# EAGLE schematic LPP MainBoard Gen_1_Ver_1 (EAGLE 7.5.0)
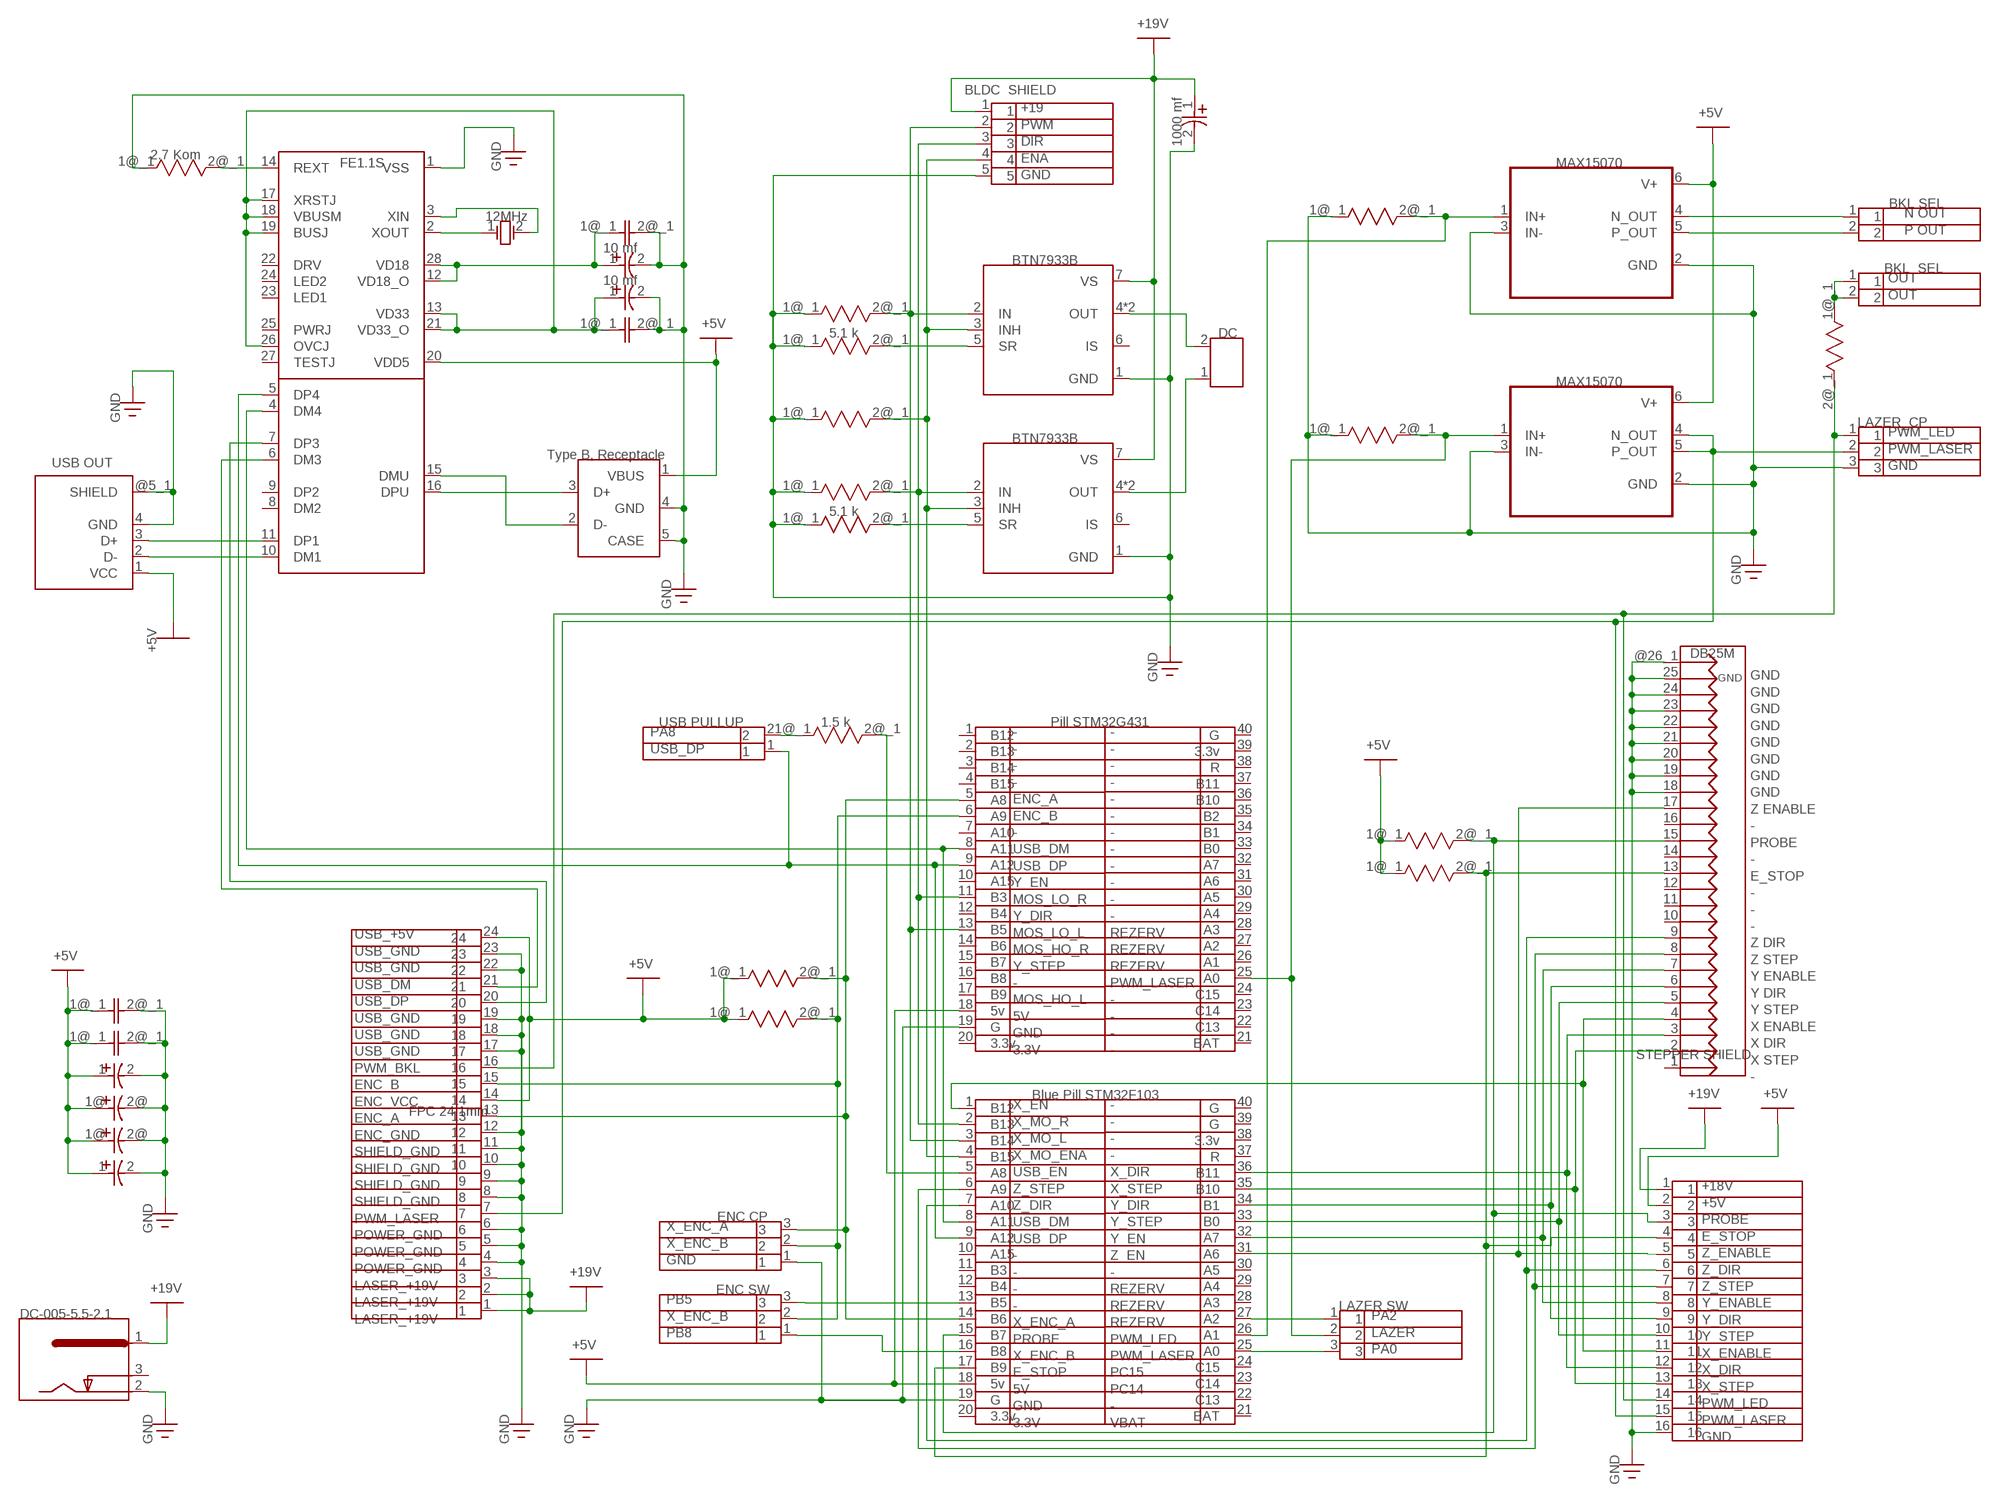
[diagram p0: schematic, sheet 1]

## Parts
BLDC  BLDC SHIELD  PLS_5  [PLS_5]
C1  1000 mf  CAP_P_5MM  [CAP_P_5MM]
C2  CAP_0805_1206  [СAP_0805_1206]
C3  10 mf  CAP_P_3MM  [CAP_P_3MM]
C4  10 mf  CAP_P_3MM  [CAP_P_3MM]
C5  CAP_0805_1206  [СAP_0805_1206]
C6  CAP_SMD_P_5MM  [СAP_P_SMD_5MM]
C7  CAP_SMD_P_5MM  [СAP_P_SMD_5MM]
C8  CAP_0805_1206  [СAP_0805_1206]
C9  CAP_0805_1206  [СAP_0805_1206]
C10  CAP_P_5MM  [CAP_P_5MM]
C11  CAP_P_5MM  [CAP_P_5MM]
CNC  DB25M  [DB25M]
DC  DC  2_SCREW_TERM._BLK.  [2_SCREW_TERM._BLK.]
DC_IN  DC-005-5.5-2.1  J-1  [J-1]
ENC_CP  ENC CP  PLS_3  [PLS_3]
ENC_SW  ENC SW  PLS_3  [PLS_3]
FPC  FPC 24 1mm  FPC_24_1MM  [FPC_24_1MM]
IC1  FE1.1S  [SOP64P600X175-28N]
LAZER_CP  LAZER_CP  PLS_3  [PLS_3]
LAZER_SW  LAZER SW  PLS_3  [PLS_3]
R1  2.7 Kom  R_0805_1206  [R_0805_1206]
R2  R_0805_1206  [R_0805_1206]
R3  R_0805_1206  [R_0805_1206]
R4  R_0805_1206  [R_0805_1206]
R5  5.1 k  R_0805_1206  [R_0805_1206]
R6  R_0805_1206  [R_0805_1206]
R7  R_0805_1206  [R_0805_1206]
R8  R_0805_1206  [R_0805_1206]
R9  5.1 k  R_0805_1206  [R_0805_1206]
R10  1.5 k  R_0805_1206  [R_0805_1206]
R11  R_0805_1206  [R_0805_1206]
R12  R_0805_1206  [R_0805_1206]
R13  R_0805_1206  [R_0805_1206]
R14  R_0805_1206  [R_0805_1206]
STEPPER_SHIELD  STEPPER SHIELD  PLS_16  [PLS_16]
U1  MAX15070  MAX15070AAUT+T  [SOT95P280X145-6N]
U3  BTN7933B  [TO127P1500X440-8N]
U4  MAX15070  MAX15070AAUT+T  [SOT95P280X145-6N]
U5  BTN7933B  [TO127P1500X440-8N]
U7  Pill STM32G431  PILL_STM32G431  [ST_PILL]
U8  Blue Pill STM32F103  BLUE_PILL_STM32F103  [ST_PILL]
USB_IN  Type B, Receptacle  USB-1_TYPE_B  [USB-1_TYPE_B]
USB_OUT  USB OUT  USB_TYPE_A_HORIZONTAL  [USB_TYPE_A_HORIZONTAL]
USB_PULLUP  USB PULLUP  PLS_2  [PLS_2]
XP2  BKL SEL  PLS_2  [PLS_2]
XP3  BKL SEL  PLS_2  [PLS_2]
Z  12MHz  Q_1  [Q_1]

## Nets
Сеть_0: BLDC.5 C1.2(MINUS) C2.2@_1 C3.2(MINUS) C4.2(MINUS) C5.2@_1 C6.2@(MINUS) C7.2@(MINUS) C8.2@_1 C9.2@_1 C10.2(MINUS) C11.2(MINUS) CNC.18 CNC.19 CNC.20 CNC.21 CNC.22 CNC.23 CNC.24 CNC.25 CNC.@26_1(GND) DC_IN.2 ENC_CP.1 FPC.4 FPC.5 FPC.6 FPC.8 FPC.9 FPC.10 FPC.11 FPC.12 FPC.17 FPC.18 FPC.19 FPC.22 FPC.23 IC1.1(VSS) LAZER_CP.3 R1.1@_1 R2.1@_1 R3.1@_1 R5.1@_1 R6.1@_1 R7.1@_1 R8.1@_1 R9.1@_1 STEPPER_SHIELD.16 U1.2(GND) U1.3(IN-) U3.1(GND) U4.2(GND) U4.3(IN-) U5.1(GND) U7.19(G) U8.19(G) USB_IN.4(GND) USB_IN.5(CASE) USB_OUT.4(GND) USB_OUT.@5_1(SHIELD) ; supply symbol labelled GND
Сеть_1: IC1.3(XIN) Z.2(OSC2)
Сеть_2: IC1.2(XOUT) Z.1(OSC1)
Сеть_3: DC.2 U3.4(OUT) U3.8(OUT)
Сеть_4: R10.2@_1 U8.5(A8)
Сеть_5: DC.1 U5.4(OUT) U5.8(OUT)
Сеть_6: ENC_CP.3 FPC.13 R13.2@_1 U7.5(A8) U8.14(B6)
Сеть_7: C6.1@(PLUS) C7.1@(PLUS) C8.1@_1 C9.1@_1 C10.1(PLUS) C11.1(PLUS) FPC.14 FPC.24 IC1.20(VDD5) R11.1@_1 R12.1@_1 R13.1@_1 R14.1@_1 STEPPER_SHIELD.2 U1.6(V+) U4.6(V+) U7.18(5v) U8.18(5v) USB_IN.1(VBUS) USB_OUT.1(VCC) ; supply symbol labelled +5V
Сеть_8: IC1.11(DP1) USB_OUT.3(D+)
Сеть_9: R10.1@_1 USB_PULLUP.2
Сеть_11: IC1.10(DM1) USB_OUT.2(D-)
Сеть_12: FPC.20 IC1.7(DP3)
Сеть_13: CNC.3 STEPPER_SHIELD.12 U8.36(B11)
Сеть_14: FPC.21 IC1.6(DM3)
Сеть_15: IC1.16(DPU) USB_IN.3(D+)
Сеть_16: BLDC.1 C1.1(PLUS) DC_IN.1 FPC.1 FPC.2 FPC.3 STEPPER_SHIELD.1 U3.7(VS) U5.7(VS) ; supply symbol labelled +19V
Сеть_17: CNC.13 R12.2@_1 STEPPER_SHIELD.4 U8.17(B9)
Сеть_18: R9.2@_1 U5.5(SR)
Сеть_19: CNC.5 STEPPER_SHIELD.10 U8.33(B0)
Сеть_20: CNC.6 STEPPER_SHIELD.9 U8.34(B1)
Сеть_21: CNC.7 STEPPER_SHIELD.8 U8.32(A7)
Сеть_22: CNC.8 STEPPER_SHIELD.7 U8.6(A9)
Сеть_23: BLDC.4 R6.2@_1 U3.3(INH) U5.3(INH) U8.4(B15)
Сеть_24: IC1.15(DMU) USB_IN.2(D-)
Сеть_25: CNC.9 STEPPER_SHIELD.6 U8.7(A10)
Сеть_26: CNC.17 STEPPER_SHIELD.5 U8.31(A6)
Сеть_27: ENC_SW.1 U8.16(B8)
Сеть_28: ENC_SW.3 U8.13(B5)
Сеть_29: CNC.4 STEPPER_SHIELD.11 U8.1(B12)
Сеть_30: FPC.7 LAZER_CP.2 STEPPER_SHIELD.15 U4.4(N_OUT) U4.5(P_OUT)
Сеть_31: R5.2@_1 U3.5(SR)
Сеть_32: CNC.15 R11.2@_1 STEPPER_SHIELD.3 U8.15(B7)
Сеть_33: ENC_CP.2 ENC_SW.2 FPC.15 R14.2@_1 U7.6(A9)
Сеть_34: BLDC.2 R3.2@_1 U3.2(IN) U7.13(B5) U8.3(B14)
Сеть_35: BLDC.3 R8.2@_1 U5.2(IN) U7.11(B3) U8.2(B13)
Сеть_36: CNC.2 STEPPER_SHIELD.13 U8.35(B10)
Сеть_37: LAZER_SW.2 R7.2@_1 U4.1(IN+) U7.25(A0)
Сеть_38: R2.2@_1 U1.1(IN+) U8.26(A1)
Сеть_39: IC1.4(DM4) U7.8(A11) U8.8(A11)
Сеть_40: IC1.5(DP4) U7.9(A12) U8.9(A12) USB_PULLUP.1
Сеть_41: C4.1(PLUS) C5.1@_1 IC1.13(VD33) IC1.17(XRSTJ) IC1.18(VBUSM) IC1.19(BUSJ) IC1.21(VD33_O) IC1.26(OVCJ)
Сеть_42: C2.1@_1 C3.1(PLUS) IC1.12(VD18_O) IC1.28(VD18)
Сеть_43: IC1.14(REXT) R1.2@_1
Сеть_44: LAZER_SW.3 U8.25(A0)
Сеть_45: LAZER_SW.1 U8.27(A2)
Сеть_46: U1.4(N_OUT) XP2.1
Сеть_47: U1.5(P_OUT) XP2.2
Сеть_48: R4.1@_1 XP3.1 XP3.2
Сеть_49: FPC.16 LAZER_CP.1 R4.2@_1 STEPPER_SHIELD.14
Unconnected: CNC.1 CNC.10 CNC.11 CNC.12 CNC.14 CNC.16 IC1.8(DM2) IC1.9(DP2) IC1.22(DRV) IC1.23(LED1) IC1.24(LED2) IC1.25(PWRJ) IC1.27(TESTJ) U3.6(IS) U5.6(IS) U7.1(B12) U7.2(B13) U7.3(B14) U7.4(B15) U7.7(A10) U7.10(A15) U7.12(B4) U7.14(B6) U7.15(B7) U7.16(B8) U7.17(B9) U7.20(3.3v) U7.21(BAT) U7.22(C13) U7.23(C14) U7.24(C15) U7.26(A1) U7.27(A2) U7.28(A3) U7.29(A4) U7.30(A5) U7.31(A6) U7.32(A7) U7.33(B0) U7.34(B1) U7.35(B2) U7.36(B10) U7.37(B11) U7.38(R) U7.39(3.3v) U7.40(G) U8.10(A15) U8.11(B3) U8.12(B4) U8.20(3.3v) U8.21(BAT) U8.22(C13) U8.23(C14) U8.24(C15) U8.28(A3) U8.29(A4) U8.30(A5) U8.37(R) U8.38(3.3v) U8.39(G) U8.40(G)

## Notes on the sheet
- +19V
- BLDC  SHIELD
- +19
  PWM
  DIR
  ENA
  GND
- +5V
- 1000 mf
- 2.7 Kom
- FE1.1S | GND | MAX15070
- BKL SEL
- N OUT
  P OUT
- 12MHz
- 10 mf
- BTN7933B
- BKL  SEL
- OUT
  OUT
- 10 mf
- +5V
- 5.1 k | DC
- MAX15070
- GND
- LAZER_CP
- PWM_LED
  PWM_LASER
  GND
- BTN7933B
- Type B, Receptacle
- USB OUT
- 5.1 k
- GND
- GND
- +5V
- DB25M
- GND
  GND
  GND
  GND
  GND
  GND
  GND
  GND
  Z ENABLE
  -
  PROBE
  -
  E_STOP
  -
  -
  -
  Z DIR
  Z STEP
  Y ENABLE
  Y DIR
  Y STEP
  X ENABLE
  X DIR
  X STEP
  -
- GND | GND
- USB PULLUP | 1.5 k | Pill STM32G431
- PA8
  USB_DP
- -
  -
  -
  -
  ENC_A
  ENC_B
  -
  USB_DM
  USB_DP
  Y_EN
  MOS_LO_R
  Y_DIR
  MOS_LO_L
  MOS_HO_R
  Y_STEP
  -
  MOS_HO_L
  5V
  GND
  3.3V
- -
  -
  -
  -
  -
  -
  -
  -
  -
  -
  -
  -
  REZERV
  REZERV
  REZERV
  PWM_LASER
  -
  -
  -
  -
- +5V
- USB_+5V
  USB_GND
  USB_GND
  USB_DM
  USB_DP
  USB_GND
  USB_GND
  USB_GND
  PWM_BKL
  ENC_B
  ENC_VCC
  ENC_A
  ENC_GND
  SHIELD_GND
  SHIELD_GND
  SHIELD_GND
  SHIELD_GND
  PWM_LASER
  POWER_GND
  POWER_GND
  POWER_GND
  LASER_+19V
  LASER_+19V
  LASER_+19V
- +5V
- +5V
- STEPPER SHIELD
- Blue Pill STM32F103 | +19V | +5V
- X_EN
  X_MO_R 
  X_MO_L 
  X_MO_ENA
  USB_EN
  Z_STEP
  Z_DIR
  USB_DM
  USB_DP
  -
  -
  -
  -
  X_ENC_A
  PROBE
  X_ENC_B
  E_STOP
  5V
  GND
  3.3V
- -
  -
  -
  -
  X_DIR
  X_STEP
  Y_DIR
  Y_STEP
  Y_EN
  Z_EN
  -
  REZERV
  REZERV
  REZERV
  PWM_LED
  PWM_LASER
  PC15
  PC14
  -
  VBAT
- FPC 24 1mm
- +18V
  +5V
  PROBE
  E_STOP
  Z_ENABLE
  Z_DIR
  Z_STEP
  Y_ENABLE
  Y_DIR
  Y_STEP
  X_ENABLE
  X_DIR
  X_STEP
  PWM_LED
  PWM_LASER
  GND
- ENC CP
- X_ENC_A
  X_ENC_B
  GND
- GND
- +19V
- +19V | ENC SW
- PB5
  X_ENC_B
  PВ8
- LAZER SW
- PA2
  LAZER
  PA0
- DC-005-5.5-2.1
- +5V
- GND | GND | GND
- GND

## Power pins joined to a net without a drawn wire
3: DC_IN.3

## Library data of the parts
BLDC = common:PLS_5; AUTHOR: Даньковский В.И.; MAIL: dvi534538@mail/ru; WEB: http://vinratel.at.ua/
C1 = common:CAP_P_5MM
C2 C5 C8 C9 = common:CAP_0805_1206
C3 C4 = common:CAP_P_3MM
C6 C7 = common:CAP_SMD_P_5MM
C10 C11 = common:CAP_P_5MM; VALUE: 1000 mf
CNC = common:DB25M; UNIQUE_NAME: TE_DB25M
DC = common:2_SCREW_TERM._BLK.
DC_IN = common:J-1
ENC_CP = common:PLS_3; AUTHOR: Даньковский В.И.; MAIL: dvi534538@mail/ru; WEB: http://vinratel.at.ua/
ENC_SW LAZER_CP LAZER_SW = common:PLS_3; AUTHOR: Даньковский В.И.; MAIL: dvi534538@mail/ru; VALUE: ENC CP; WEB: http://vinratel.at.ua/
FPC = common:FPC_24_1MM; PART_NUMBER_(DIGI-KEY): A123109-ND; UNIQUE_NAME: TE_1734366-4
IC1 = common:FE1.1S; AVAILABILITY: In Stock; CHECK_PRICES: https://www.snapeda.com/parts/FE1.1S/Terminus/view-part/?ref=eda; DESCRIPTION: USB 2.0 HIGH SPEED 4-PORT HUB CONTROLLER; MF: terminus; MP: FE1.1S; PACKAGE: None; PRICE: None; SNAPEDA_LINK: https://www.snapeda.com/parts/FE1.1S/Terminus/view-part/?ref=snap
R1 = common:R_0805_1206
R2-R14 = common:R_0805_1206; VALUE: 2.7 Kom
STEPPER_SHIELD = common:PLS_16; AUTHOR: Даньковский В.И.; MAIL: dvi534538@mail/ru; WEB: http://vinratel.at.ua/
U1 U4 = common:MAX15070AAUT+T; AVAILABILITY: In Stock; CHECK_PRICES: https://www.snapeda.com/parts/MAX15070AAUT+T/Maxim+Integrated/view-part/?ref=eda; DESCRIPTION: Low-Side Gate Driver IC Inverting, Non-Inverting SOT-23-6; MF: Maxim Integrated Products; MP: MAX15070AAUT+T; PACKAGE: SOT-23-6 Maxim Integrated; PRICE: None; SNAPEDA_LINK: https://www.snapeda.com/parts/MAX15070AAUT+T/Maxim+Integrated/view-part/?ref=snap
U3 U5 = common:BTN7933B; AVAILABILITY: Not in stock; CHECK_PRICES: https://www.snapeda.com/parts/IFX007T/Infineon/view-part/?ref=eda; DESCRIPTION: Half Bridge Driver DC Motors, General Purpose Power MOSFET PG-TO263-7-1; MF: Infineon Technologies; MP: IFX007T; PACKAGE: TO-263-8 Infineon Technologies; PRICE: None; SNAPEDA_LINK: https://www.snapeda.com/parts/IFX007T/Infineon/view-part/?ref=snap
U7 = common:PILL_STM32G431
U8 = common:BLUE_PILL_STM32F103
USB_IN = common:USB-1_TYPE_B; PART_NUMBER_(DIGI-KEY): A123109-ND; UNIQUE_NAME: TE_1734366-4
USB_OUT = common:USB_TYPE_A_HORIZONTAL; AVAILABILITY: In Stock; CHECK_PRICES: https://www.snapeda.com/parts/875832010BLF/Amphenol/view-part/?ref=eda; DESCRIPTION: Case material: Thermoplastic UL94V-O; Connection (components): SMD; Connector standard: USB 2.0 type A socket; Connector type: Socket, horizontal mount; Contact material: Copper alloy; Factory colour: White; Pins: 4; Product size (length): 14.50 mm; Product size (width): 14 mm; Type (misc.): 1 Port; MF: Amphenol; MP: 875832010BLF; PACKAGE: None; PRICE: None; SNAPEDA_LINK: https://www.snapeda.com/parts/875832010BLF/Amphenol/view-part/?ref=snap
USB_PULLUP = common:PLS_2; AUTHOR: Даньковский В.И.; MAIL: dvi534538@mail/ru; WEB: http://vinratel.at.ua/
XP2 XP3 = common:PLS_2; AUTHOR: Даньковский В.И.; MAIL: dvi534538@mail/ru; VALUE: USB PULLUP; WEB: http://vinratel.at.ua/
Z = common:Q_1